# EAGLE design Rectifier mk2 (EAGLE 8.0.0)
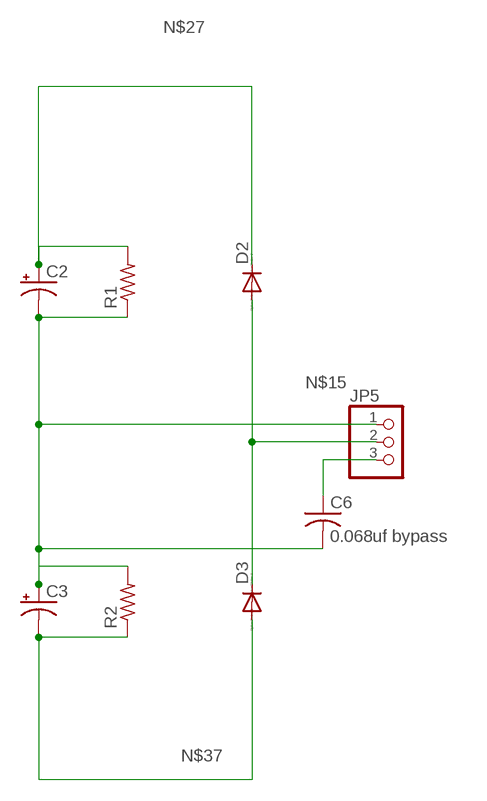
[diagram p0: schematic, sheet 1]

## Parts
C2  CPOL-USE10-35  [EB35D]
C3  CPOL-USE10-35  [EB35D]
C6  0.068uf bypass  C-US150-084X183  [C150-084X183]
D2  DIODE-TO220V  [TO220ACS]
D3  DIODE-TO220V  [TO220ACS]
JP5  PINHD-1X3-9.5  [1X03-9.5]
R1  R-US_0207/10  [0207/10]
R2  R-US_0207/10  [0207/10]

## Nets
N$11: C6.1 JP5.3
N$13 [NEG]: C2.- C3.+ C6.2 JP5.1 R1.1 R2.2
N$15 [NEG]: D2.A D3.C JP5.2
N$27 [VCC]: C2.+ D2.C R1.2
N$37 [NEG]: C3.- D3.A R2.1

## Library data of the parts
C2 C3 = rcl:CPOL-US: POLARIZED CAPACITOR, American symbol
C6 = adafruit:C-US: CAPACITOR, American symbol
D2 D3 = diode:DIODE-: DIODE
JP5 = pinhead:PINHD-1X3-9.5: PIN HEADER
R1 R2 = resistor:R-US_: RESISTOR, American symbol

## Net classes
1 Power1: width 10.16 mm, clearance 1.27 mm
2 NEG: width 7.62 mm, clearance 1.27 mm
3 VCC: width 7.62 mm

## Board
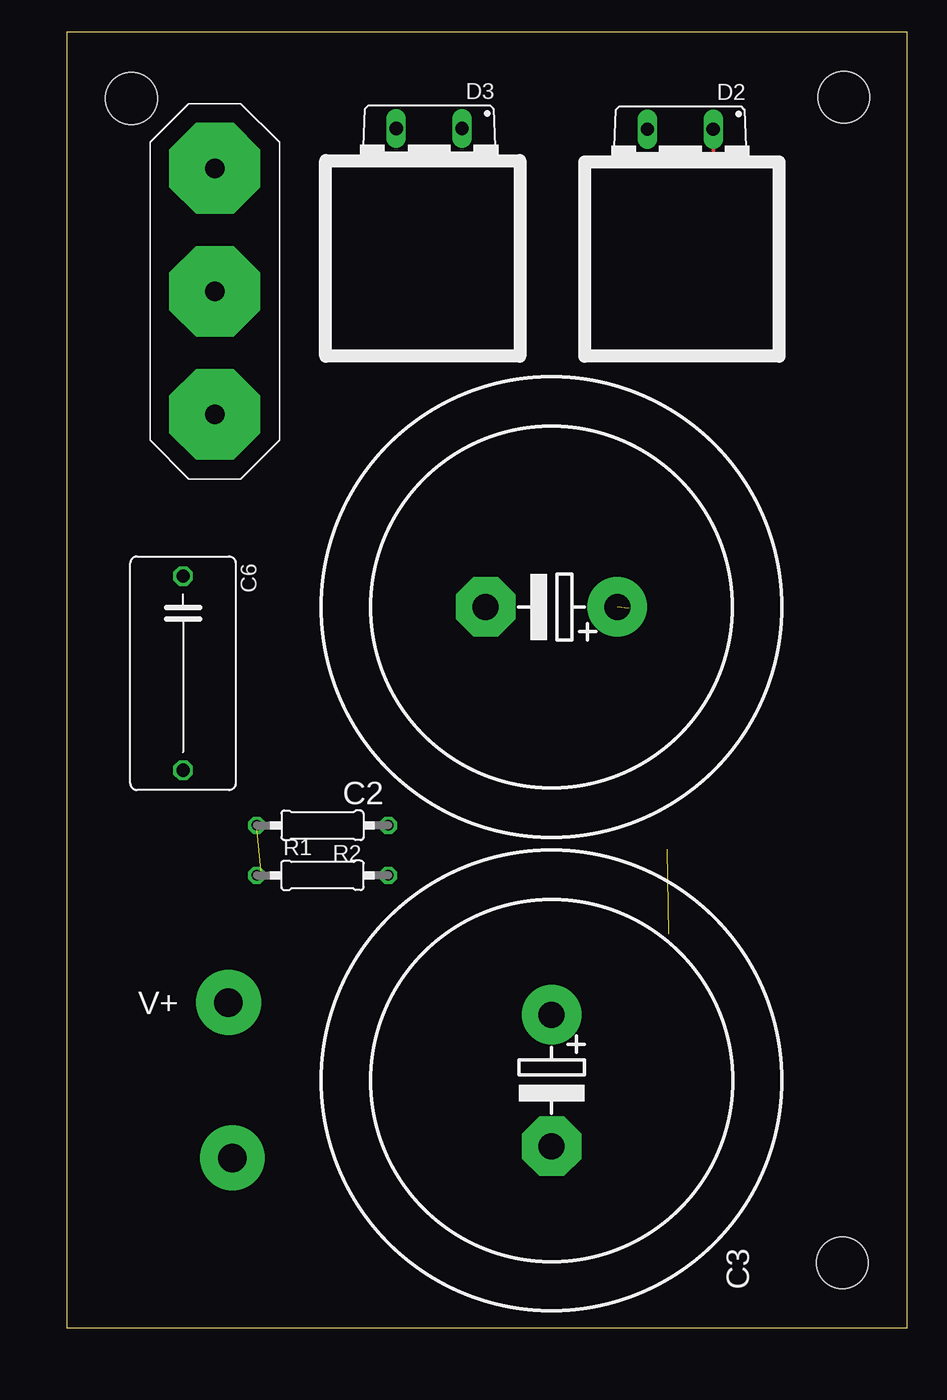
[diagram p1: board, top side]
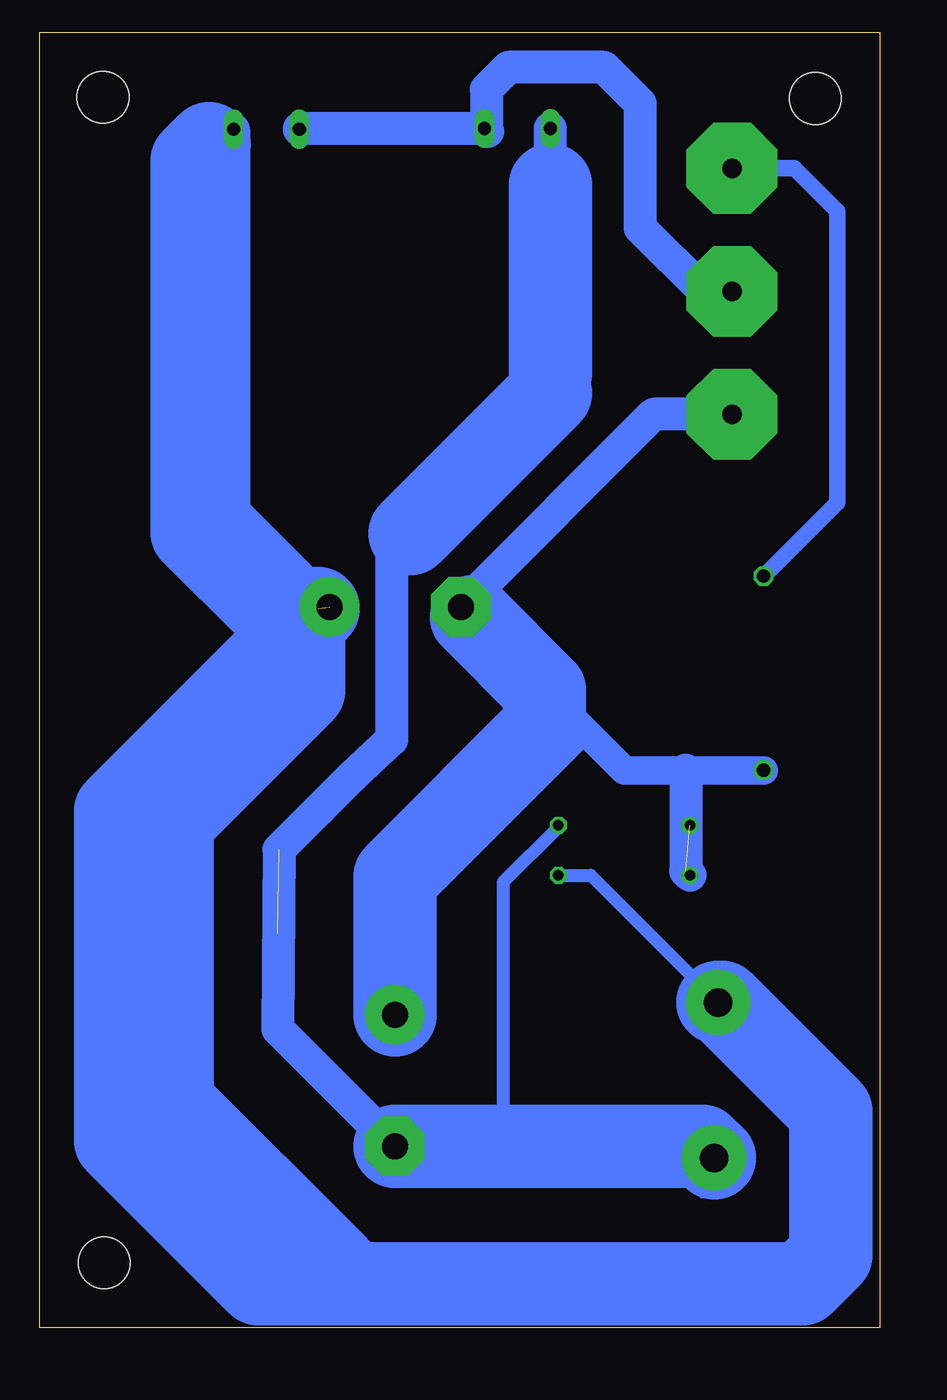
[diagram p2: board, bottom side, seen from below]

Size 64.9 x 100 mm. Coordinates in mm from the lower left corner, seen from the top.
Outline: 0,0 64.9,0 64.9,100 0,100 0,0
Copper layers (1*16): Top 0.035mm / dielectric 1.5mm / Bottom 0.035mm
Design rules "default": minimum track width 10mil, minimum drill 24mil, track to track 8mil, track to pad 8mil, pad to pad 8mil, via to via 8mil, smd to smd 8mil, copper to edge 40mil, drill to drill 8mil, minimum pad ring 10mil, minimum via ring 8mil, stop-mask expansion 4mil, vias tented up to drill 0mil, thermal gap 10mil
Holes 4 mm at 5,94.9 60,95 59.9,5

### Footprints (pad centres in the part's own frame; a part is rotated, then mirrored left to right if it is on the bottom)
EB35D = drill 2.007 pad 4.597: + -5.08,0 | drill 2.007 pad 4.597 octagon: - 5.08,0
C150-084X183 = drill 1.016 octagon: 1 -7.493,0; 2 7.493,0
TO220ACS = drill 1.016 long: A 2.54,-2.54; C -2.54,-2.54
1X03-9.5 = drill 1.5 pad 7 octagon: 1 -9.5,0; 2 0,0; 3 9.5,0
0207/10 = drill 0.813 octagon: 1 -5.08,0; 2 5.08,0

### Placement (x,y rotation side)
C2  37.43,55.64 180 top
C3  37.45,19.08 270 top
C6  8.98,50.52 270 top
D2  47.38,89.98 180 top
D3  27.99,90.04 180 top
JP5  11.43,80.01 90 top
R1  19.75,34.92 0 top
R2  19.75,38.78 180 top

### Tracks (layer width: path | path; a pad name or v marks a point on that pad's centre or on a via)
N$11
  Bottom 1.27: JP5.3 6.61,89.51 3.3,86.2 3.3,63.69 C6.1
N$13  (1 unrouted)
  Bottom 2.184: C6.2 15,43.03 19.74,43.03 31.55,54.84 C2.-
  Bottom 2.54: JP5.1 17.48,70.51 C2.- | 15,43.03 15,35.25 R1.1 | C3.+ 37.45,31.85 23.4,45.9
  Bottom 6.452: C3.+ 37.45,34.85 25.9,46.4 25.9,49.19 31.55,54.84
N$15
  Bottom 2.54: D3.C 44.84,92.58 D2.A | 30.3,92.35 D3.C | JP5.2 13.61,80.01 18.5,84.9 18.5,94.5 21.3,97.3 28.7,97.3 30.4,95.6 30.4,92.71 D3.C
N$27  (via drill 2.2 pad 5)  (1 unrouted)
  Top 0.254: D2.C 49.92,90.12 49.8,90
  Bottom 1.016: R1.2 22.32,34.92 v12.5,25.1
  Bottom 2.54: D2.C 49.92,63.05 C2.+ | 11.6,25 12.4,25 v12.5,25.1
  Bottom 6.452: v12.5,25.1 12.2,25.1 3.8,16.7 3.8,5.6 6,3.4 48,3.4 59,14.4 59,39.9 43.4,55.5 | 54.65,44.25 54.65,37.9 | 54.65,37.9 54.65,17.35 41.9,4.6 | 54.65,37.9 54.65,39.05 44.5,49.2 44.5,54.4 43.4,55.5 | 43.4,55.5 47.2,55.5 53.1,61.4 53.1,90.1 51.8,91.4
N$37  (via drill 2.2 pad 5)  (1 unrouted)
  Bottom 0.254: v12.8,13.1 13.8,10.1
  Bottom 1.016: R2.1 24.83,38.67 29.1,34.4 29.1,13.9 29.6,13.4 36.85,13.4 C3.-
  Bottom 2.54: 25.45,72.15 25.45,73.7 | 25.45,88.2 D3.A | 36.3,61.3 37.7,59.9 37.7,45.4 40.8,42.5 43.3,40 46.4,36.9 46.5,23.05 C3.-
  Bottom 6.452: C3.- 13.7,14 v12.8,13.1 | 36.3,61.3 25.45,72.15 | 25.45,73.7 25.45,88.2
(copper drawn outside any net)
  shapes: Bottom area x1

### Text on the board
tPlace: V+